# EAGLE design analog (EAGLE 7.4.0)
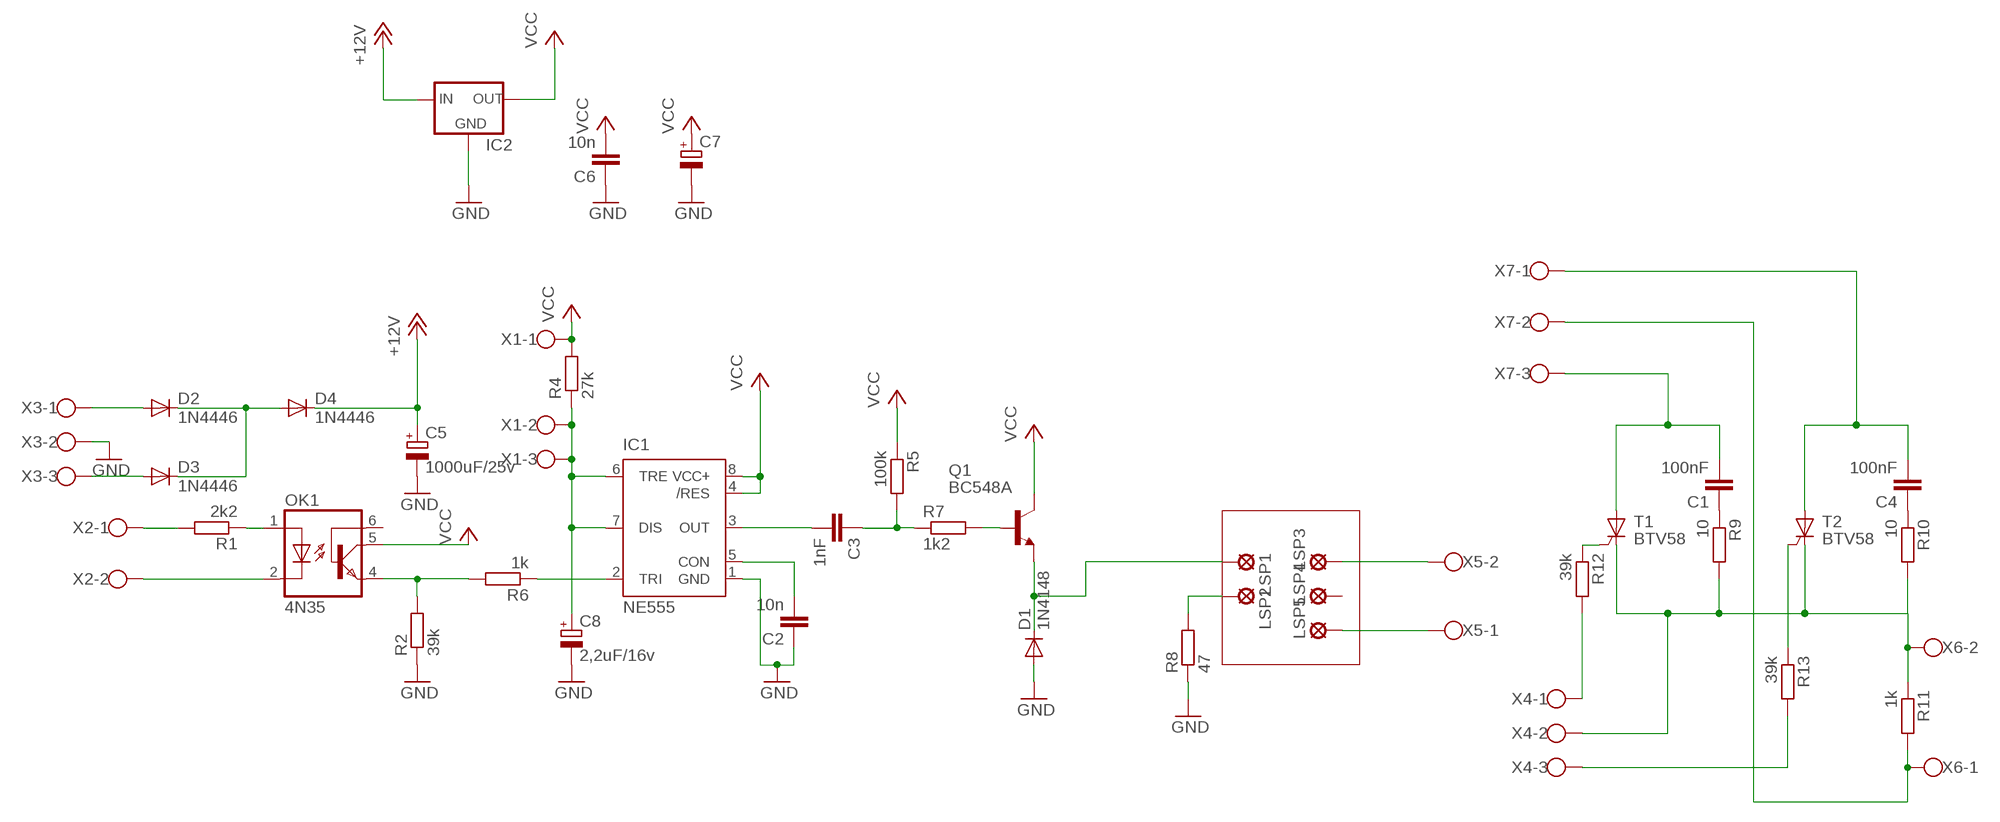
[diagram p0: schematic, sheet 1]

## Parts
C1  100nF  C-EU050-025X075  [C050-025X075]
C2  10n  C-EU050-025X075  [C050-025X075]
C3  1nF  C-EU050-025X075  [C050-025X075]
C4  100nF  C-EU050-025X075  [C050-025X075]
C5  1000uF/25v  CPOL-EUE5-8.5  [E5-8,5]
C6  10n  C-EU050-025X075  [C050-025X075]
C7  CPOL-EUE2.5-5  [E2,5-5]
C8  2,2uF/16v  CPOL-EUE2.5-5  [E2,5-5]
D1  1N4148  1N4148DO35-10  [DO35-10]
D2  1N4446  [DO35-10]
D3  1N4446  [DO35-10]
D4  1N4446  [DO35-10]
IC1  NE555  [DIL-08]
IC2  78XXS  [78XXS]
LSP1  MCS10B  [MCS10B]
LSP2  MCS10B  [MCS10B]
LSP3  MCS10B  [MCS10B]
LSP4  MCS10B  [MCS10B]
LSP5  MCS10B  [MCS10B]
OK1  4N35  [DIL06]
Q1  BC548A  [TO92-EBC]
R1  2k2  R-EU_0207/10  [0207/10]
R2  39k  R-EU_0207/10  [0207/10]
R4  27k  R-EU_0207/10  [0207/10]
R5  100k  R-EU_0207/10  [0207/10]
R6  1k  R-EU_0207/10  [0207/10]
R7  1k2  R-EU_0207/10  [0207/10]
R8  47  R-EU_0207/10  [0207/10]
R9  10  R-EU_0207/10  [0207/10]
R10  10  R-EU_0207/10  [0207/10]
R11  1k  R-EU_0207/10  [0207/10]
R12  39k  R-EU_0207/10  [0207/10]
R13  39k  R-EU_0207/10  [0207/10]
T1  BTV58  [TO220CS]
T2  BTV58  [TO220CS]
X1  W237-103  [W237-103]
X2  W237-102  [W237-102]
X3  W237-103  [W237-103]
X4  W237-103  [W237-103]
X5  W237-102  [W237-102]
X6  W237-102  [W237-102]
X7  W237-103  [W237-103]

## Nets
+12V: C5.+ D4.C IC2.IN
GND: C2.1 C5.- C6.1 C7.- C8.- D1.A IC1.1(GND) IC2.GND R2.1 R8.1 X3.2
N$1: OK1.1(A) R1.1
N$2: OK1.4(EMI) R2.2 R6.2
N$3: C2.2 IC1.5(CON)
N$4: IC1.2(TRI) R6.1
N$5: C8.+ IC1.6(TRE) IC1.7(DIS) R4.1 X1.2 X1.3
N$6: C3.1 R5.2 R7.1
N$7: C3.2 IC1.3(OUT)
N$8: Q1.B R7.2
N$9: D1.C LSP1.MP Q1.E
N$10: D2.C D3.C D4.A
N$11: R1.2 X2.1
N$12: D2.A X3.1
N$13: D3.A X3.3
N$14: OK1.2(C) X2.2
N$15: LSP2.MP R8.2
N$16: R12.2 X4.1
N$17: LSP3.MP X5.2
N$18: LSP5.MP X5.1
N$19: C1.1 R9.1
N$20: C1.2 T1.A X7.3
N$21: R11.2 X6.1 X7.2
N$22: C4.1 R10.1
N$23: C4.2 T2.A X7.1
N$24: R13.2 X4.3
N$25: R12.1 T1.G
N$26: R13.1 T2.G
N$27: R9.2 R10.2 R11.1 T1.C T2.C X4.2 X6.2
VCC: C6.2 C7.+ IC1.4(/RES) IC1.8(VCC+) IC2.OUT OK1.5(COL) Q1.C R4.2 R5.1 X1.1
Unconnected: LSP4.MP OK1.6(BAS)

## Library data of the parts
C1-C4 C6 = rcl:C-EU: CAPACITOR, European symbol
C5 C7 C8 = rcl:CPOL-EU: POLARIZED CAPACITOR, European symbol
D1 = diode:1N4148: DIODE high speed (Philips)
D2-D4 = diode:1N4446: DIODE high speed (Philips)
IC1 = st-microelectronics:NE555: General purpose bipolar Timer; MF: Arrow Electronics; MPN: NE555N; OC_FARNELL: 1467742; OC_NEWARK: 89K1486
IC2 = v-reg:78XXS: VOLTAGE REGULATOR
LSP1-LSP5 = solpad:MCS10B: SOLDER PAD MC S1, distributor Buerklin, 15F505
OK1 = optocoupler:4N35: MOTOROLA OPTO COUPLER; MF: FAIRCHILD SEMICONDUCTOR; MPN: 4N35; OC_FARNELL: 1328375; OC_NEWARK: 72K9946
Q1 = transistor-npn:BC548*: NPN Transistor
R1 R2 R4-R13 = rcl:R-EU_: RESISTOR, European symbol
T1 T2 = triac:BTV58: THYRISTOR
X1 X3 X4 X7 = con-wago-500:W237-103: WAGO SCREW CLAMP; MPN: 237-103; OC_FARNELL: unknown; OC_NEWARK: 18M7116
X2 X5 X6 = con-wago-500:W237-102: WAGO SCREW CLAMP; MPN: 237-102; OC_FARNELL: unknown; OC_NEWARK: 70K9898

## Board
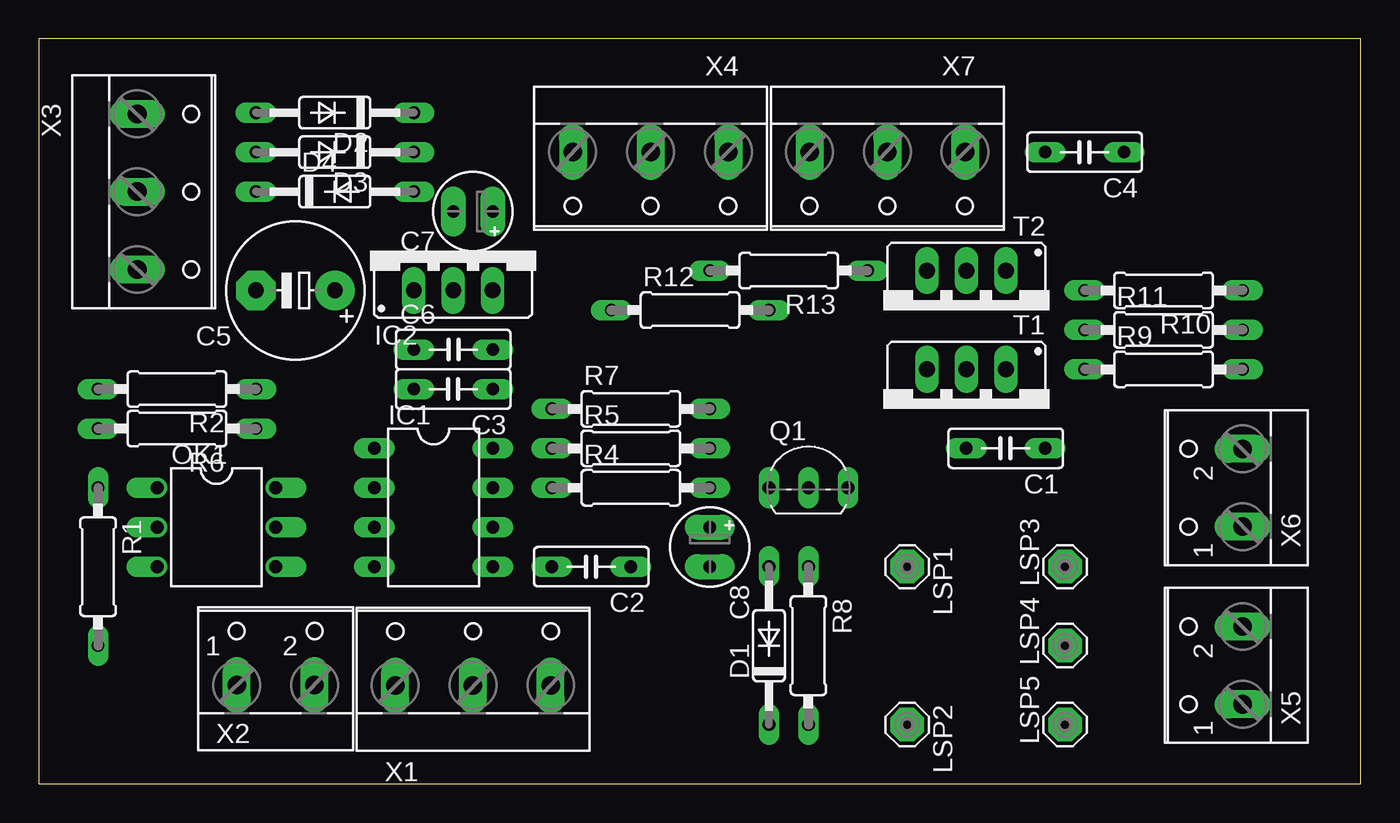
[diagram p1: board, top side]
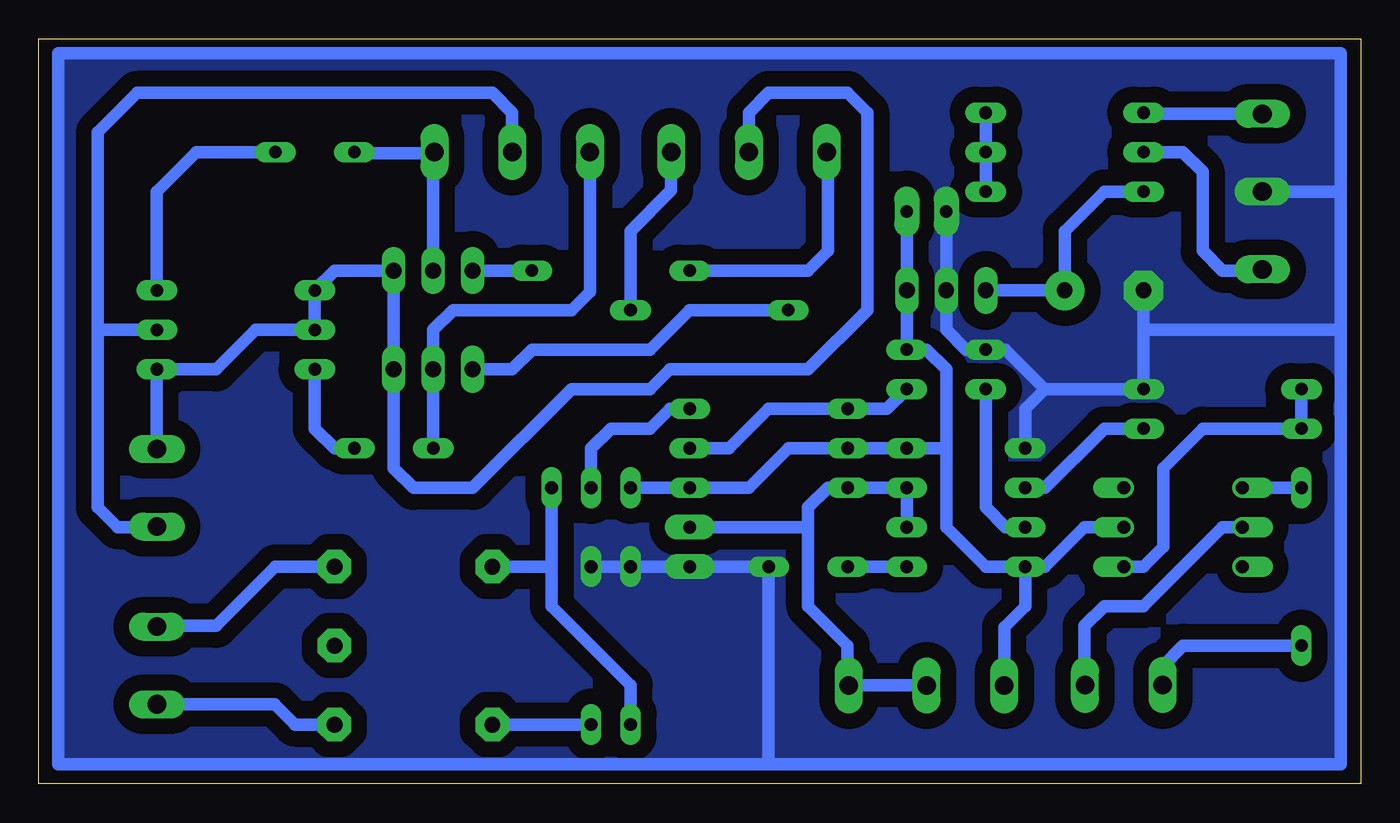
[diagram p2: board, bottom side, seen from below]

Size 85.07 x 47.93 mm. Coordinates in mm from the lower left corner, seen from the top.
Outline: 0,0 85.07,0 85.07,47.93 0,47.93 0,0
Copper layers (1*16): Top 0.035mm / dielectric 1.5mm / Bottom 0.035mm
Design rules "default": minimum track width 10mil, minimum drill 24mil, track to track 8mil, track to pad 8mil, pad to pad 8mil, via to via 8mil, smd to smd 8mil, copper to edge 40mil, drill to drill 8mil, minimum pad ring 10mil, minimum via ring 8mil, stop-mask expansion 4mil, vias tented up to drill 0mil, thermal gap 10mil

### Footprints (pad centres in the part's own frame; a part is rotated, then mirrored left to right if it is on the bottom)
C050-025X075 = drill 0.813 long: 1 -2.54,0; 2 2.54,0
E5-8,5 = drill 1.016 pad 2.54: + -2.54,0 | drill 1.016 pad 2.54 octagon: - 2.54,0
E2,5-5 = drill 0.813 pad 1.6 long: + -1.27,0; - 1.27,0
DO35-10 = drill 0.813 long: A 5.08,0; C -5.08,0
DIL-08 = drill 0.813 long: 1 -3.81,-3.81; 2 -1.27,-3.81; 3 1.27,-3.81; 4 3.81,-3.81; 5 3.81,3.81; 6 1.27,3.81; 7 -1.27,3.81; 8 -3.81,3.81
78XXS = drill 1.016 long: GND 0,-2.54; IN -2.54,-2.54; OUT 2.54,-2.54
MCS10B = drill 1.016 pad 2.159 octagon: MP 0,0
DIL06 = drill 0.813 offset: 1 -2.54,-3.81; 2 0,-3.81; 3 2.54,-3.81; 4 2.54,3.81; 5 0,3.81; 6 -2.54,3.81
TO92-EBC = drill 0.813 long: B 0,-1.27; C -2.54,-1.27; E 2.54,-1.27
0207/10 = drill 0.813 long: 1 -5.08,0; 2 5.08,0
TO220CS = drill 1.016 long: A 0,-2.54; C -2.54,-2.54; G 2.54,-2.54
W237-103 = drill 1.194 long: 1 -5,-1.29; 2 0,-1.29; 3 5,-1.29
W237-102 = drill 1.194 long: 1 -2.5,-1.27; 2 2.5,-1.27

### Placement (x,y rotation side)
C1  62.23,21.59 180 top
C2  35.56,13.97 180 top
C3  26.67,25.4 180 top
C4  67.31,40.64 180 top
C5  16.51,31.75 180 top
C6  26.67,27.94 0 top
C7  27.94,36.83 180 top
C8  43.18,15.24 270 top
D1  46.99,8.89 90 top
D2  19.05,43.18 180 top
D3  19.05,40.64 180 top
D4  19.05,38.1 0 top
IC1  25.4,17.78 270 top
IC2  26.67,34.29 0 top
LSP1  55.88,13.97 270 top
LSP2  55.88,3.81 270 top
LSP3  66.04,13.97 90 top
LSP4  66.04,8.89 90 top
LSP5  66.04,3.81 90 top
OK1  11.43,16.51 270 top
Q1  49.53,20.32 0 top
R1  3.81,13.97 270 top
R2  8.89,25.4 180 top
R4  38.1,19.05 0 top
R5  38.1,21.59 0 top
R6  8.89,22.86 180 top
R7  38.1,24.13 0 top
R8  49.53,8.89 270 top
R9  72.39,26.67 0 top
R10  72.39,31.75 180 top
R11  72.39,29.21 0 top
R12  41.91,30.48 0 top
R13  48.26,33.02 180 top
T1  59.69,24.13 180 top
T2  59.69,30.48 180 top
X1  27.94,7.62 0 top
X2  15.24,7.62 0 top
X3  7.62,38.1 270 top
X4  39.37,39.37 180 top
X5  76.2,7.62 90 top
X6  76.2,19.05 90 top
X7  54.61,39.37 180 top

### Tracks (layer width: path | path; a pad name or v marks a point on that pad's centre or on a via)
+12V
  Bottom 0.813: D4.C 16.51,38.1 19.05,35.56 C5.+ IC2.IN
GND
  Bottom 0.813: X3.2 1.27,38.1 | 1.27,38.1 1.27,46.99 83.82,46.99 83.82,1.27 38.1,1.27 | 38.1,1.27 1.27,1.27 1.27,29.21 | 1.27,29.21 1.27,38.1 | 38.1,1.27 C2.1 C8.- R8.1 D1.A | 13.97,29.21 R2.1 20.32,25.4 | 13.97,29.21 1.27,29.21 | 20.32,25.4 21.59,24.13 IC1.1 | C5.- 13.97,29.21 | 20.32,25.4 22.86,27.94 C6.1 25.4,27.94 26.67,29.21 IC2.GND C7.-
  pour Bottom (isolate 1.016, no thermals): 0,48.26 85.09,48.26 85.09,0 0,0
N$1
  Bottom 0.813: OK1.1 R1.1
N$2
  Bottom 0.813: R2.2 R6.2 10.16,22.86 12.7,20.32 12.7,15.24 13.97,13.97 OK1.4
N$3
  Bottom 0.813: IC1.5 C2.2
N$4
  Bottom 0.813: R6.1 16.51,22.86 20.32,19.05 IC1.2
N$5
  Bottom 0.813: IC1.6 IC1.7 R4.1 34.29,19.05 35.56,17.78 35.56,16.51 | X1.2 X1.3 33.02,6.41 33.02,8.89 35.56,11.43 35.56,16.51 | C8.+ 35.56,16.51
N$6
  Bottom 0.813: C3.1 30.48,24.13 R7.1 38.1,24.13 40.64,21.59 R5.2
N$7
  Bottom 0.813: C3.2 24.13,17.78 22.86,16.51 IC1.3
N$8
  Bottom 0.813: R7.2 44.45,24.13 45.72,22.86 48.26,22.86 49.53,21.59 Q1.B
N$9
  Bottom 0.813: D1.C 46.99,6.35 52.07,11.43 52.07,13.97 | Q1.E 52.07,13.97 | LSP1.MP 52.07,13.97
N$10
  Bottom 0.813: D2.C D3.C D4.A
N$11
  Bottom 0.813: X2.1 12.74,7.58 11.43,8.89 R1.2
N$12
  Bottom 0.813: X3.1 13.89,43.1 D2.A
N$13
  Bottom 0.813: D3.A 11.43,40.64 10.16,39.37 10.16,34.29 8.89,33.02 6.41,33.02 X3.3
N$14
  Bottom 0.813: OK1.2 8.89,16.51 13.97,11.43 16.51,11.43 17.78,10.16 17.78,6.35 X2.2
N$15
  Bottom 0.813: R8.2 LSP2.MP
N$16
  Bottom 0.813: X4.1 44.37,38.18 46.99,35.56 R12.2
N$17
  Bottom 0.813: LSP3.MP 69.85,13.97 73.66,10.16 77.43,10.16 X5.2
N$18
  Bottom 0.813: X5.1 69.89,5.12 68.58,3.81 LSP5.MP
N$19
  Bottom 0.813: R9.1 67.31,22.86 66.04,21.59 C1.1
N$20
  Bottom 0.813: X7.3 49.61,31.67 50.8,30.48 58.42,30.48 59.69,29.21 T1.A C1.2
N$21
  Bottom 0.813: X7.2 54.61,43.18 55.88,44.45 78.74,44.45 81.28,41.91 81.28,29.21 | 81.28,29.21 81.28,17.78 80.01,16.51 77.51,16.51 X6.1 | R11.2 81.28,29.21
N$22
  Bottom 0.813: C4.1 74.93,40.64 77.47,38.1 R10.1
N$23
  Bottom 0.813: T2.A 59.69,40.58 | 59.69,40.58 X7.1 | 59.69,40.58 64.71,40.58 C4.2
N$24
  Bottom 0.813: R13.2 35.56,33.02 34.29,34.29 34.29,40.64 34.35,40.64 X4.3
N$25
  Bottom 0.813: T1.G 54.61,26.67 53.34,27.94 45.72,27.94 43.18,30.48 R12.1
N$26
  Bottom 0.813: T2.G R13.1
N$27
  Bottom 0.813: X6.2 R9.2 73.66,26.67 71.12,29.21 R11.1 R10.2 66.04,33.02 T2.C T1.C 62.23,20.32 60.96,19.05 57.15,19.05 50.8,25.4 45.72,25.4 44.45,26.67 35.56,26.67 31.75,30.48 31.75,43.18 33.02,44.45 38.1,44.45 39.37,43.18 X4.2
VCC
  Bottom 0.813: IC1.4 24.13,13.97 26.67,16.51 26.67,21.59 | OK1.5 17.78,16.51 20.32,13.97 IC1.4 | X1.1 22.94,10.08 21.59,11.43 IC1.4 | Q1.C R4.2 39.37,19.05 36.83,21.59 R5.1 IC1.8 26.67,21.59 | C7.+ IC2.OUT C6.2 27.94,27.94 26.67,26.67 26.67,21.59